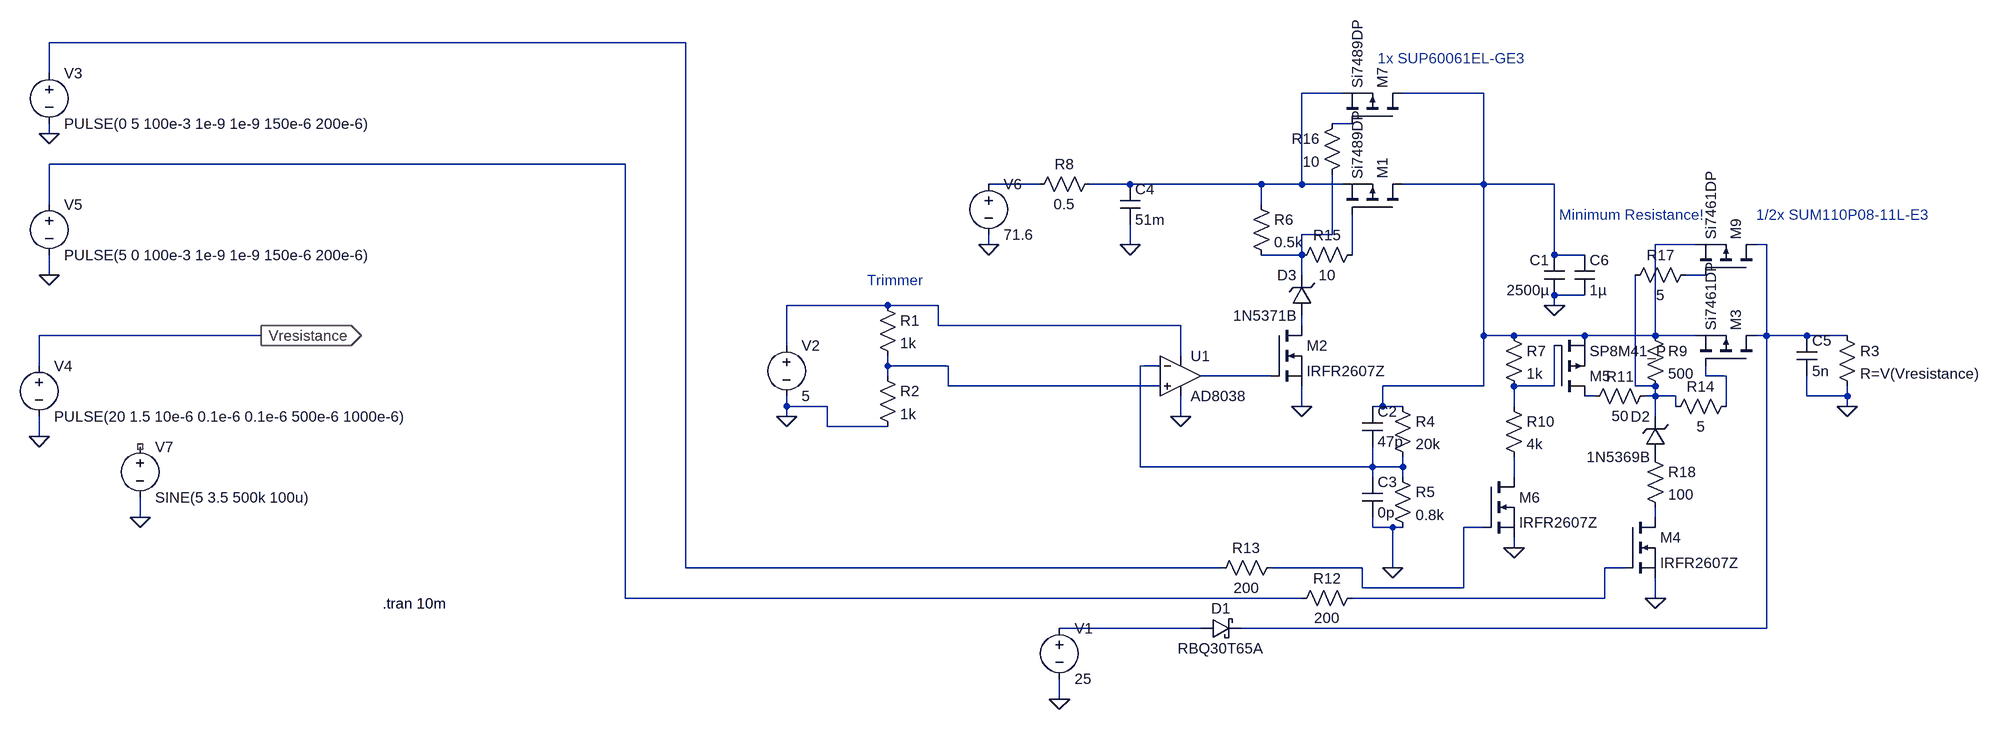
[diagram p0: schematic Voltage_Controller.asc]
Voltage_Controller.asc, the LTspice schematic file:
Version 4
SHEET 1 3624 680
WIRE 448 -640 -560 -640
WIRE -560 -592 -560 -640
WIRE 1488 -560 1424 -560
WIRE 1712 -560 1584 -560
WIRE 1504 -512 1472 -512
WIRE -560 -496 -560 -512
WIRE 352 -448 -560 -448
WIRE 1008 -416 928 -416
WIRE 1152 -416 1088 -416
WIRE 1360 -416 1152 -416
WIRE 1424 -416 1424 -560
WIRE 1424 -416 1360 -416
WIRE 1488 -416 1424 -416
WIRE 1712 -416 1712 -560
WIRE 1712 -416 1584 -416
WIRE 1824 -416 1712 -416
WIRE -560 -384 -560 -448
WIRE 1360 -384 1360 -416
WIRE 1472 -336 1472 -432
WIRE 1472 -336 1424 -336
WIRE 928 -320 928 -336
WIRE 1152 -320 1152 -352
WIRE 2048 -320 1984 -320
WIRE 2160 -320 2144 -320
WIRE 1424 -304 1424 -336
WIRE 1424 -304 1360 -304
WIRE 1504 -304 1504 -368
WIRE 1824 -304 1824 -416
WIRE 1872 -304 1824 -304
WIRE -560 -272 -560 -304
WIRE 1424 -272 1424 -304
WIRE 2064 -272 2032 -272
WIRE 1872 -240 1824 -240
WIRE 768 -224 608 -224
WIRE 848 -224 768 -224
WIRE 1824 -224 1824 -240
WIRE 848 -192 848 -224
WIRE 1232 -192 848 -192
WIRE 1424 -192 1424 -208
WIRE -224 -176 -576 -176
WIRE 1712 -176 1712 -416
WIRE 1760 -176 1712 -176
WIRE 1872 -176 1760 -176
WIRE 1984 -176 1984 -320
WIRE 1984 -176 1872 -176
WIRE 2048 -176 1984 -176
WIRE 2160 -176 2160 -320
WIRE 2160 -176 2144 -176
WIRE 2224 -176 2160 -176
WIRE 2288 -176 2224 -176
WIRE 608 -160 608 -224
WIRE 1232 -144 1232 -192
WIRE -576 -128 -576 -176
WIRE 768 -128 768 -144
WIRE 864 -128 768 -128
WIRE 1200 -128 1168 -128
WIRE 768 -112 768 -128
WIRE 1376 -112 1264 -112
WIRE 2064 -112 2064 -128
WIRE 2096 -112 2064 -112
WIRE 864 -96 864 -128
WIRE 1200 -96 864 -96
WIRE 1712 -96 1712 -176
WIRE 1712 -96 1552 -96
WIRE 1824 -96 1824 -160
WIRE 1824 -96 1760 -96
WIRE 1952 -96 1952 -272
WIRE 1984 -96 1952 -96
WIRE 1888 -80 1872 -80
WIRE 1984 -80 1984 -96
WIRE 1984 -80 1968 -80
WIRE 2016 -80 1984 -80
WIRE 2224 -80 2224 -112
WIRE 2288 -80 2288 -96
WIRE 2288 -80 2224 -80
WIRE 608 -64 608 -80
WIRE 672 -64 608 -64
WIRE 1424 -64 1424 -96
WIRE 1552 -64 1552 -96
WIRE 1552 -64 1536 -64
WIRE 1584 -64 1552 -64
WIRE 1760 -64 1760 -96
WIRE 2016 -64 2016 -80
WIRE 2096 -64 2096 -112
WIRE 2288 -64 2288 -80
WIRE 608 -48 608 -64
WIRE 1232 -48 1232 -80
WIRE 1984 -48 1984 -80
WIRE 672 -32 672 -64
WIRE 768 -32 672 -32
WIRE -576 -16 -576 -48
WIRE 1168 32 1168 -128
WIRE 1536 32 1536 0
WIRE 1536 32 1168 32
WIRE 1584 32 1584 16
WIRE 1584 32 1536 32
WIRE 1536 48 1536 32
WIRE 1584 48 1584 32
WIRE 1760 48 1760 16
WIRE -416 112 -416 80
WIRE 1984 112 1984 96
WIRE 1536 128 1536 112
WIRE 1568 128 1536 128
WIRE 1584 128 1568 128
WIRE 1712 128 1680 128
WIRE 1760 160 1760 144
WIRE 448 192 448 -640
WIRE 1296 192 448 192
WIRE 1520 192 1376 192
WIRE 1568 192 1568 128
WIRE 1936 192 1904 192
WIRE 1520 224 1520 192
WIRE 1680 224 1680 128
WIRE 1680 224 1520 224
WIRE 352 240 352 -448
WIRE 1424 240 352 240
WIRE 1904 240 1904 192
WIRE 1904 240 1504 240
WIRE 1984 240 1984 208
WIRE 1264 288 1040 288
WIRE 2160 288 2160 -176
WIRE 2160 288 1328 288
WIRE 1040 400 1040 368
FLAG 608 -48 0
FLAG -576 -16 0
FLAG -224 -176 Vresistance
IOPIN -224 -176 Out
FLAG -560 -272 0
FLAG 928 -320 0
FLAG 1424 -64 0
FLAG 1232 -48 0
FLAG 1824 -224 0
FLAG 1568 192 0
FLAG 1152 -320 0
FLAG 1040 400 0
FLAG 2288 -64 0
FLAG 1984 240 0
FLAG 1760 160 0
FLAG -560 -496 0
FLAG -416 112 0
SYMBOL voltage 608 -176 R0
WINDOW 123 0 0 Left 0
WINDOW 39 0 0 Left 0
SYMATTR InstName V2
SYMATTR Value 5
SYMBOL voltage -576 -144 R0
WINDOW 123 0 0 Left 0
WINDOW 39 0 0 Left 0
SYMATTR InstName V4
SYMATTR Value PULSE(20 1.5 10e-6 0.1e-6 0.1e-6 500e-6 1000e-6)
SYMBOL voltage -560 -400 R0
WINDOW 123 0 0 Left 0
WINDOW 39 0 0 Left 0
SYMATTR InstName V5
SYMATTR Value PULSE(5 0 100e-3 1e-9 1e-9 150e-6 200e-6)
SYMBOL pmos 1584 -368 M270
SYMATTR InstName M1
SYMATTR Value Si7489DP
SYMBOL voltage 928 -432 R0
WINDOW 123 0 0 Left 0
WINDOW 39 0 0 Left 0
SYMATTR InstName V6
SYMATTR Value 71.6
SYMBOL res 1344 -400 R0
SYMATTR InstName R6
SYMATTR Value 0.5k
SYMBOL nmos 1376 -192 R0
SYMATTR InstName M2
SYMATTR Value IRFR2607Z
SYMBOL res 752 -240 R0
SYMATTR InstName R1
SYMATTR Value 1k
SYMBOL res 752 -128 R0
SYMATTR InstName R2
SYMATTR Value 1k
SYMBOL cap 1840 -240 R180
WINDOW 0 24 56 Left 2
WINDOW 3 24 8 Left 2
SYMATTR InstName C1
SYMATTR Value 2500µ
SYMATTR SpiceLine Rser=0.014
SYMBOL res 2272 -192 R0
SYMATTR InstName R3
SYMATTR Value R=V(Vresistance)
SYMBOL res 1568 -80 R0
SYMATTR InstName R4
SYMATTR Value 20k
SYMBOL res 1568 32 R0
SYMATTR InstName R5
SYMATTR Value 0.8k
SYMBOL cap 1520 -64 R0
SYMATTR InstName C2
SYMATTR Value 47p
SYMBOL cap 1520 48 R0
SYMATTR InstName C3
SYMATTR Value 0p
SYMBOL cap 1136 -416 R0
SYMATTR InstName C4
SYMATTR Value 51m
SYMATTR SpiceLine Rser=0.003
SYMBOL res 1104 -432 R90
WINDOW 0 0 56 VBottom 2
WINDOW 3 32 56 VTop 2
SYMATTR InstName R8
SYMATTR Value 0.5
SYMBOL pmos 2144 -128 M270
SYMATTR InstName M3
SYMATTR Value Si7461DP
SYMBOL voltage 1040 272 R0
WINDOW 123 0 0 Left 0
WINDOW 39 0 0 Left 0
SYMATTR InstName V1
SYMATTR Value 25
SYMBOL schottky 1264 304 R270
WINDOW 0 32 32 VTop 2
WINDOW 3 0 32 VBottom 2
SYMATTR InstName D1
SYMATTR Value RBQ30T65A
SYMBOL res 1968 -192 R0
SYMATTR InstName R9
SYMATTR Value 500
SYMBOL nmos 1936 112 R0
SYMATTR InstName M4
SYMATTR Value IRFR2607Z
SYMBOL cap 2208 -176 R0
SYMATTR InstName C5
SYMATTR Value 5n
SYMBOL res 1520 224 R90
WINDOW 0 0 56 VBottom 2
WINDOW 3 32 56 VTop 2
SYMATTR InstName R12
SYMATTR Value 200
SYMBOL zener 2000 16 R180
WINDOW 0 24 64 Left 2
WINDOW 3 24 0 Left 2
SYMATTR InstName D2
SYMATTR Value 1N5369B
SYMBOL zener 1440 -208 R180
WINDOW 0 24 64 Left 2
WINDOW 3 24 0 Left 2
SYMATTR InstName D3
SYMATTR Value 1N5371B
SYMBOL pmos 1824 -80 M180
SYMATTR InstName M5
SYMATTR Value SP8M41_P
SYMBOL res 1744 -192 R0
SYMATTR InstName R7
SYMATTR Value 1k
SYMBOL res 1744 -80 R0
SYMATTR InstName R10
SYMATTR Value 4k
SYMBOL nmos 1712 48 R0
SYMATTR InstName M6
SYMATTR Value IRFR2607Z
SYMBOL voltage -560 -608 R0
WINDOW 123 0 0 Left 0
WINDOW 39 0 0 Left 0
SYMATTR InstName V3
SYMATTR Value PULSE(0 5 100e-3 1e-9 1e-9 150e-6 200e-6)
SYMBOL res 1984 -96 R90
WINDOW 0 0 56 VBottom 2
WINDOW 3 32 56 VTop 2
SYMATTR InstName R11
SYMATTR Value 50
SYMBOL res 1392 176 R90
WINDOW 0 0 56 VBottom 2
WINDOW 3 32 56 VTop 2
SYMATTR InstName R13
SYMATTR Value 200
SYMBOL res 2112 -80 R90
WINDOW 0 0 56 VBottom 2
WINDOW 3 32 56 VTop 2
SYMATTR InstName R14
SYMATTR Value 5
SYMBOL res 1520 -320 R90
WINDOW 0 0 56 VBottom 2
WINDOW 3 32 56 VTop 2
SYMATTR InstName R15
SYMATTR Value 10
SYMBOL OpAmps\\AD8038 1232 -176 R0
SYMATTR InstName U1
SYMBOL voltage -416 -16 R0
WINDOW 123 0 0 Left 0
WINDOW 39 0 0 Left 0
SYMATTR InstName V7
SYMATTR Value SINE(5 3.5 500k 100u)
SYMBOL pmos 1584 -512 M270
SYMATTR InstName M7
SYMATTR Value Si7489DP
SYMBOL pmos 2144 -272 M270
SYMATTR InstName M9
SYMATTR Value Si7461DP
SYMBOL res 1488 -528 M0
SYMATTR InstName R16
SYMATTR Value 10
SYMBOL res 2048 -288 R90
WINDOW 0 0 56 VBottom 2
WINDOW 3 32 56 VTop 2
SYMATTR InstName R17
SYMATTR Value 5
SYMBOL cap 1856 -304 R0
SYMATTR InstName C6
SYMATTR Value 1µ
SYMATTR SpiceLine Rser=0.001
SYMBOL res 1968 0 R0
SYMATTR InstName R18
SYMATTR Value 100
TEXT -32 248 Left 2 !.tran 10m
TEXT 1832 -368 Left 2 ;Minimum Resistance!
TEXT 1544 -616 Left 2 ;1x SUP60061EL-GE3
TEXT 2144 -368 Left 2 ;1/2x SUM110P08-11L-E3
TEXT 736 -264 Left 2 ;Trimmer

The netlist it stands for:
* Voltage_Controller.asc
V2 N011 0 5
V4 Vresistance 0 PULSE(20 1.5 10e-6 0.1e-6 0.1e-6 500e-6 1000e-6)
V5 N005 0 PULSE(5 0 100e-3 1e-9 1e-9 150e-6 200e-6)
M1 N003 N009 N002 N002 Si7489DP
V6 N006 0 71.6
R6 N002 N007 0.5k
M2 N012 N015 0 0 IRFR2607Z
R1 N011 N013 1k
R2 N013 0 1k
C1 0 N003 2500µ Rser=0.014
R3 N008 0 R=V(Vresistance)
R4 N003 N014 20k
R5 N014 0 0.8k
C2 N003 N014 47p
C3 N014 0 0p
C4 N002 0 51m Rser=0.003
R8 N002 N006 0.5
M3 N008 N016 N003 N003 Si7461DP
V1 N024 0 25
D1 N024 N008 RBQ30T65A
R9 N003 N018 500
M4 N021 N023 0 0 IRFR2607Z
C5 N008 0 5n
R12 N023 N005 200
D2 P001 N018 1N5369B
D3 N012 N007 1N5371B
M5 N019 N017 N003 N003 SP8M41_P
R7 N003 N017 1k
R10 N017 N020 4k
M6 N020 N022 0 0 IRFR2607Z
V3 N001 0 PULSE(0 5 100e-3 1e-9 1e-9 150e-6 200e-6)
R11 N018 N019 50
R13 N022 N001 200
R14 N016 N018 5
R15 N009 N007 10
XU1 N013 N014 N011 0 N015 AD8038  ; pins In+ In- V+ V- OUT
V7 NC_01 0 SINE(5 3.5 500k 100u)
M7 N003 N004 N002 N002 Si7489DP
M9 N008 N010 N003 N003 Si7461DP
R16 N004 N007 10
R17 N010 N018 5
C6 N003 0 1µ Rser=0.001
R18 P001 N021 100
.model D D
.lib standard.dio
.model NMOS NMOS
.model PMOS PMOS
.lib standard.mos
.tran 10m
* Minimum Resistance!
* 1x SUP60061EL-GE3
* 1/2x SUM110P08-11L-E3
* Trimmer
.backanno
.end